# Altium schematic sheet Detector.SchDoc: Sensor Module - Detector
size A4; CompanyName: UofT Capstone Team 2024991; DrawnBy: Tony Kim; Revision: 1; SheetNumber: 3; SheetTotal: 3
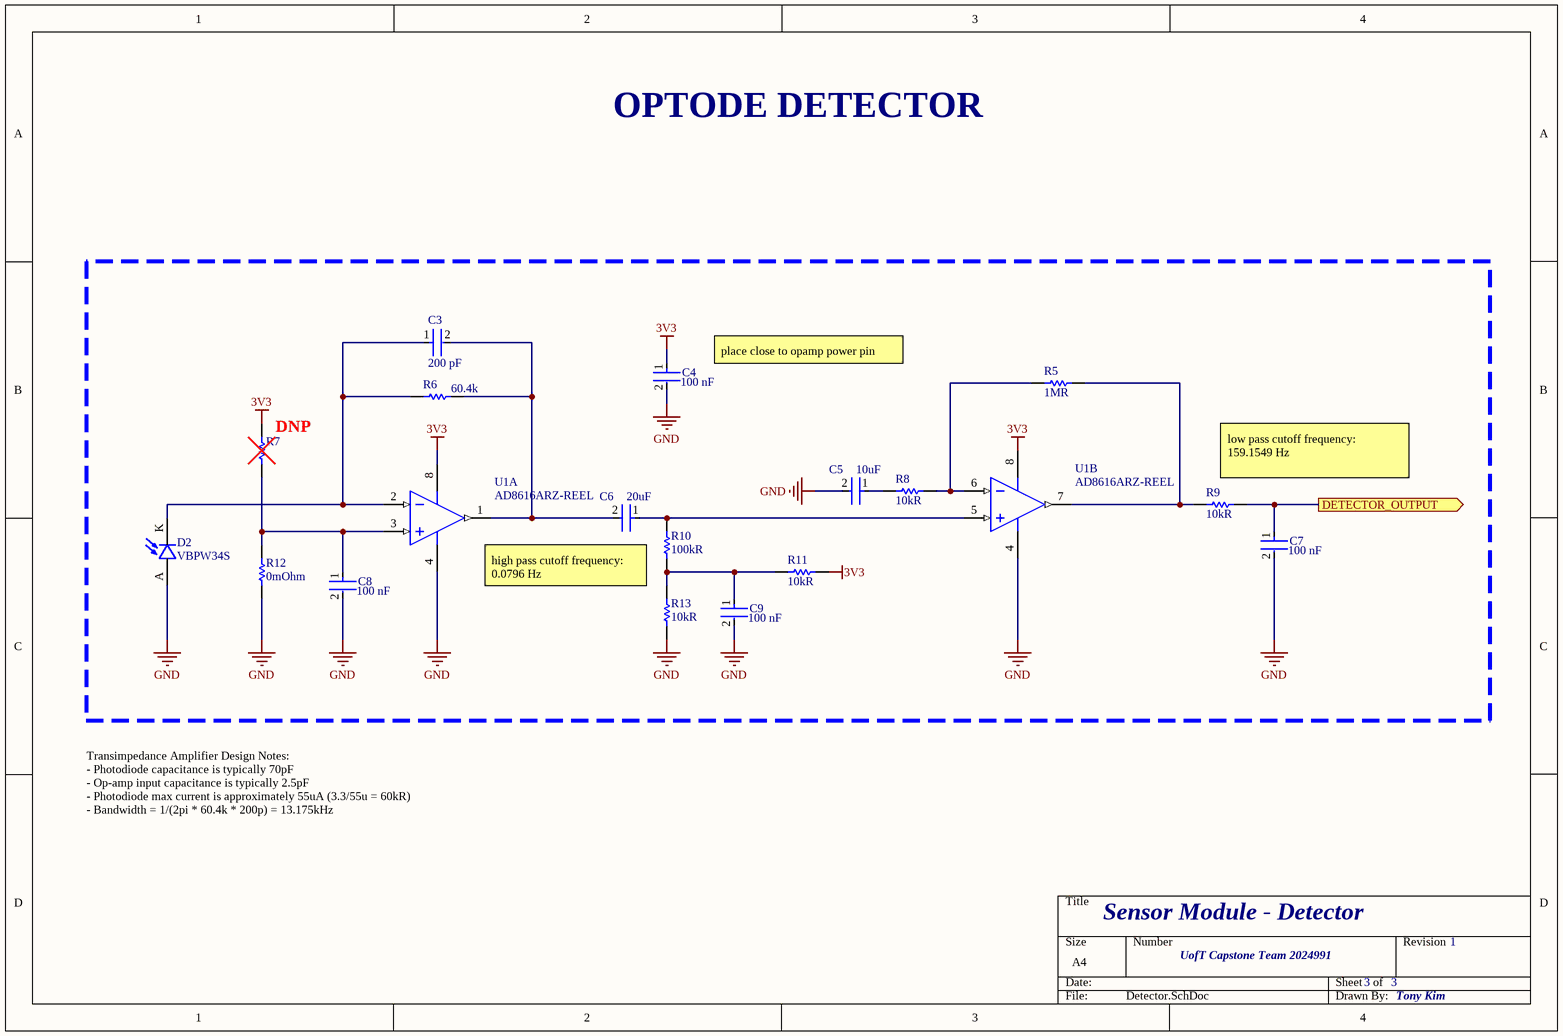
[diagram p0: Detector.SchDoc]

## Parts
C3  Capacitance: 200 pF  [FP-C0603C-CF-MFG]  (hidden comment: C0603C201J5GACTU)
C4  Capacitance: 100 nF  [FP-CC0603-DA-MFG]  (hidden comment: CC0603KRX7R7BB104)
C5  Capacitance: 10uF  [FP-GRM188-0_1-e0_2_0_55-IPC_C]  (hidden comment: GRM188R60J106ME47D)
C6  Capacitance: 20uF  [FP-GRM188-0_1-e0_2_0_55-IPC_A]  (hidden comment: GRM188R60J106ME47D)
C7  Capacitance: 100 nF  [FP-CC0603-DA-MFG]  (hidden comment: CC0603KRX7R7BB104)
C8  Capacitance: 100 nF  [FP-CC0603-DA-MFG]  (hidden comment: CC0603KRX7R7BB104)
C9  Capacitance: 100 nF  [FP-CC0603-DA-MFG]  (hidden comment: CC0603KRX7R7BB104)
D2  VBPW34S  [XDCR_VBPW34S]
R5  Resistance: 1MR  [RESC1608X55X25LL10T15]  (hidden comment: RC0603FR-071ML)
R6  Resistance: 60.4k  [RESC1608X55X25ML10T15]  (hidden comment: RC0603FR-0760K4L)
R7  CRCW060310K0FKEA  [RESC1609X50X30NL8T20]  (value not drawn)  (no BOM)
R8  Resistance: 10kR  [RESC1609X50X30NL8T20]  (hidden comment: CRCW060310K0FKEA)
R9  Resistance: 10kR  [RESC1609X50X30NL8T20]  (hidden comment: CRCW060310K0FKEA)
R10  Resistance: 100kR  [RESC1608X55X30ML15T15]  (hidden comment: ERJ-3EKF1003V)
R11  Resistance: 10kR  [RESC1609X50X30NL8T20]  (hidden comment: CRCW060310K0FKEA)
R12  Resistance: 0mOhm  [RESC1608X55X25ML10T15]  (hidden comment: RC0603JR-070RL)
R13  Resistance: 10kR  [RESC1609X50X30NL8T20]  (hidden comment: CRCW060310K0FKEA)
U1  AD8616ARZ-REEL  [ADI-R-8_N]  (parts A,B of 2)

## Blocks framed on the sheet
DNP: C3-C9 D2 R5-R13 U1

## Ports
DETECTOR_OUTPUT (out, see Top[2B])

## Nets
3V3: C4.1 R7.2 R11.2 U1.8(+V)
GND: C4.2 C5.2 C7.2 C8.2 C9.2 D2.A R12.1 R13.1 U1.4(-V)
DETECTOR_OUTPUT: C7.1 R9.1 ; port DETECTOR_OUTPUT
NetC3_1: C3.1 D2.K(C) R6.1 U1.2(-IN_A)
NetC3_2: C3.2 C6.2 R6.2 U1.1(OUT_A)
NetC5_1: C5.1 R8.1
NetC6_1: C6.1 R10.2 U1.5(+IN_B)
NetC8_1: C8.1 R7.1 R12.2 U1.3(+IN_A)
NetC9_1: C9.1 R10.1 R11.1 R13.2
NetR5_1: R5.1 R9.2 U1.7(OUT_B)
NetR5_2: R5.2 R8.2 U1.6(-IN_B)

## Notes on the sheet
- OPTODE DETECTOR
- (near C4) place close to opamp power pin
- (near R9) low pass cutoff frequency: 159.1549 Hz
- high pass cutoff frequency: 0.0796 Hz
- Transimpedance Amplifier Design Notes:
  - Photodiode capacitance is typically 70pF
  - Op-amp input capacitance is typically 2.5pF
  - Photodiode max current is approximately 55uA (3.3/55u = 60kR)
  - Bandwidth = 1/(2pi * 60.4k * 200p) = 13.175kHz

## Library data of the parts
C3 = CMP-1035-01444-3: CAP CER 200PF 50V 5% NP0 0603; Manufacturer: KEMET; Automotive Grade: Grade 1; Temperature Characteristic: C0G; Temperature Coefficient: 30ppm/°C; Tolerance: 0.05; Material: Ceramic; Temperature Range High: +125°C; Digikey Description: CAP CER 200PF 50V 5% NP0 0603; ComponentLink2Description: Datasheet; Package: C0603C-CF; Value: 200 pF; Mouser Description: Multilayer Ceramic Capacitors MLCC - SMD/SMT 50volts 200pF C0G 5%; Voltage Rating: 50 V; Temperature Range Low: -55°C; Device Class L2: Capacitors; Temperature: -55°C to +125°C; Device Class L1: Passive Components; Device Class L3: Ceramic Capacitors; ComponentLink2URL: https://api.kemet.com/component-edge/download/datasheet/C0603C100J5GACAUTO.pdf; Height: 0.87mm; Automotive: Yes; Octopart: https://octopart.com/c0603c201j5gactu-kemet-9143917; Category: Cap; Manufacturer Part Number: C0603C201J5GACTU; Lead Free: Yes; RoHS: TRUE
C4 C7-C9 = CMP-2000-05002-2: CAP CER 0.1UF 16V X7R 0603; Manufacturer: YAGEO; Tolerance: 0.1; Value: 100 nF; Temperature Coefficient: 15%; Material: Ceramic; Voltage Rating: 16 V; Package: CC0603-DA; ComponentLink2Description: Datasheet; Octopart: https://octopart.com/cc0603krx7r7bb104-yageo-192941; Temperature Range High: +125°C; Digikey Description: CAP CER 0.1UF 16V X7R 0603; Voltage: 16 V; Device Class L2: Capacitors; Height: 0.9mm; Temperature: -55°C to +125°C; Manufacturer Part Number: CC0603KRX7R7BB104; Device Class L1: Passive Components; Device Class L3: Ceramic Capacitors; ComponentLink2URL: http://www.yageo.com/documents/recent/UPY-GPHC_X7R_6.3V-to-50V_18.pdf; Footprint Url: http://www.yageo.com/exep/pages/download/literatures/UPY-C_GEN_24.pdf; RoHS: TRUE; Temperature Range Low: -55°C; Temperature Characteristic: X7R; Lead Free: Yes; Category: Cap; Mouser Description: Multilayer Ceramic Capacitor, CC Series, 0.1 - F, - 10%, X7R, 16 V, 0603 [1608 Metric]; Automotive: No
C5 = CMP-2006-02792-2: Chip Multilayer Ceramic Capacitors for General Purpose, 0603, 10uF, X5R, 15%, 20%, 6.3V; Packaging: Tape and Reel; Voltage Rating (DC): 6.3V; Width: 0.031inch; Termination: SMD/SMT; Dielectric: X5R; Package Quantity: 4000; Voltage Rating: 6.3V; Case/Package: 0603; Min Operating Temperature: -55°C; Voltage: 6.3V; Length: 1.6mm; Thickness: 0.035inch; Lead Free: Lead Free; Depth: 0.8mm; Case Code (Imperial): 0603; Max Operating Temperature: 85°C; Material: Ceramic; Height: 0.8mm; Tolerance: 20%; Mount: Surface Mount; REACH SVHC: No SVHC; Radiation Hardening: No; Case Code (Metric): 1608; Value: 10uF
C6 = CMP-2006-02792-2: Chip Multilayer Ceramic Capacitors for General Purpose, 0603, 10uF, X5R, 15%, 20%, 6.3V; Value: 20uF; Packaging: Tape and Reel; Voltage Rating (DC): 6.3V; Width: 0.031inch; Termination: SMD/SMT; Dielectric: X5R; Package Quantity: 4000; Voltage Rating: 6.3V; Case/Package: 0603; Min Operating Temperature: -55°C; Voltage: 6.3V; Length: 1.6mm; Thickness: 0.035inch; Lead Free: Lead Free; Depth: 0.8mm; Case Code (Imperial): 0603; Max Operating Temperature: 85°C; Material: Ceramic; Height: 0.8mm; Tolerance: 20%; Mount: Surface Mount; REACH SVHC: No SVHC; Radiation Hardening: No; Case Code (Metric): 1608
D2 = VBPW34S: Photodiode 940nm 100ns 130Â° 2-SMD, Gull Wing; MF: Vishay; Price: None; MP: VBPW34S; Value: *; Package: SMD-2 Vishay; SnapEDA_Link: https://www.snapeda.com/parts/VBPW34S/Vishay%20Semiconductor%20Opto%20Division/view-part/139260/?ref=snap; Availability: Unavailable
R5 = CMP-1659-00056-1: Chip Resistor, 1 MOhm, +/- 1%, 100 mW, -55 to 155 degC, 0603 (1608 Metric), RoHS, Tape and Reel; Voltage Rating (DC): 25 V; Tolerance: 20%; Case\Package: Radial; Min Operating Temperature: -40 degC; PackageDescription: 2-Pin Surface Mount Device, Body 1.6 x 0.8 mm; ComponentLink1Description: Manufacturer URL; Radiation Hardening: No; DatasheetVersion: Rev. 4, 02/2016; REACH SVHC: No SVHC; Length: 20 mm; Max Operating Temperature: 85 degC; Diameter: 10 mm; Packaging: Bulk; Package Quantity: 200; PackageReference: 0603; Mount: Through Hole; ComponentLink1URL: http://www.yageo.com/; ComponentLink2URL: http://www.yageo.com/documents/recent/PYu-RC_Group_51_RoHS_L_04.pdf; ComponentLink2Description: Datasheet; Width: 0 inch; Lead Pitch: 5 mm; RoHSCompliant: true; Voltage Rating: 25 V; Height: 20 mm
R6 = CMP-2000-04099-1: Manufacturer: Yageo; Value: 60.4k; Part Number: RC0603FR-0760K4L
R7 = CMP-1666-00005-4: Chip Resistor, 10 KOhm, +/- 1%, 100 mW, -55 to 155 degC, 0603 (1608 Metric), RoHS, Tape and Reel; Manufacturer: Vishay Semiconductor; Voltage Rating: 75 V; Resistance: 10kR; Value: 10kR; Max Operating Temperature: 155 degC; PackageDescription: 2-Pin Surface Mount Device, Body 1.575 x 0.85 mm; ComponentLink1Description: Manufacturer URL; RoHSCompliant: true; PackageReference: 0603; REACH SVHC: Unknown; Length: 1.55 mm; DatasheetVersion: 06/2012; Packaging: Tape and Reel; Min Operating Temperature: -55 degC; Mounting Technology: Surface Mount; ComponentLink2URL: https://datasheet.ciiva.com/11809/0900766b80d98afc-11809037.pdf; Height: 0.45 mm; ComponentLink2Description: Datasheet; Package Quantity: 5000; ComponentLink1URL: http://www.vishay.com/
R8 R9 R11 R13 = CMP-1666-00005-4: Chip Resistor, 10 KOhm, +/- 1%, 100 mW, -55 to 155 degC, 0603 (1608 Metric), RoHS, Tape and Reel; Manufacturer: Vishay Semiconductor; Voltage Rating: 75 V; Value: 10kR; Max Operating Temperature: 155 degC; PackageDescription: 2-Pin Surface Mount Device, Body 1.575 x 0.85 mm; ComponentLink1Description: Manufacturer URL; RoHSCompliant: true; PackageReference: 0603; REACH SVHC: Unknown; Length: 1.55 mm; DatasheetVersion: 06/2012; Packaging: Tape and Reel; Min Operating Temperature: -55 degC; Mounting Technology: Surface Mount; ComponentLink2URL: https://datasheet.ciiva.com/11809/0900766b80d98afc-11809037.pdf; Height: 0.45 mm; ComponentLink2Description: Datasheet; Package Quantity: 5000; ComponentLink1URL: http://www.vishay.com/
R10 = CMP-2000-00182-1: Manufacturer: Panasonic; Value: 100kR; Part Number: ERJ-3EKF1003V
R12 = CMP-2100-03667-1: Chip Resistor, 0 Ohm, +/- 5%, 0.1 W, -55 to 155 degC, 0603 (1608 Metric), RoHS, Tape and Reel; Manufacturer: Yageo; Temperature Coefficient: 200ppm/degreesC; Voltage Rating: 50V; Power Rating: 100mW; Width: 0.8mm; Max Operating Temperature: 155degC; Tolerance: 5%; Package Reference: 0603; Height: 0.45mm; Depth: 0.8mm; Package Description: 2-Pin Surface Mount Device, Body 1.6 x 0.8 mm; Termination: SMD/SMT; Package Quantity: 5000; Case/Package: 0603; Case Code (Imperial): 0603; Radiation Hardening: No; Number of Pins: 2; Length: 1.6mm; Lead Free: LeadFree; Voltage Rating (DC): 50V; Military Standard: Not; Datasheet URL: http://www.yageo.com/NewPortal/yageodocoutput?fileName=/pdf/R-Chip/PYu-RC_Group_51_RoHS_L_5.pdf; Manufacturer URL: http://www.yageo.com/; Packaging: TapeandReel; Case Code (Metric): 1608; Min Operating Temperature: -55degC; Composition: ThickFilm; RoHSCompliant: true; Contact Plating: Tin; Datasheet Version: Rev. 5, 10/2016; REACH SVHC: NoSVHC
U1 = CMP-0384-00619-1: Double Channel Wide Bandwidth Operational Amplifier, 24 MHz BW, 12 V/us SR, Industrial, 8-pin SOIC (R-8), Reel; Manufacturer: Analog Devices; Generic Part Number: AD8616; Input Bias Current: 200fA; V Span Max: 6V; Small Signal Bandwidth: 24MHz; Amplifiers Per Package: 2; Slew Rate: 12V/us; V Span Min: 2.7V; Iq/Amp: 2mA; Input Offset Voltage: 23uV; PackageReference: R-8; PartNumber: AD8616ARZ-REEL; DatasheetVersion: Rev. E; ComponentLink2URL: http://www.analog.com/static/imported-files/data_sheets/AD8615_8616_8618.pdf; Code_JEDEC: MS-012-AA; Mounting Technology: Surface Mount; PackageVersion: 060506-A; ComponentLink3Description: Package Specification; ComponentLink3URL: http://www.analog.com/static/imported-files/packages/PKG_PDF/SOIC_Narrow%20(R)/R_8.pdf; ComponentLink1Description: Manufacturer URL; ComponentLink2Description: Datasheet; PackageDescription: 8-Pin Standard Small Outline Package, Body 3.9 x 4.9 mm, Pitch 1.27 mm; ComponentLink1URL: http://www.analog.com/en/index.html